# Altium schematic sheet analogSwitch.SchDoc
size Letter
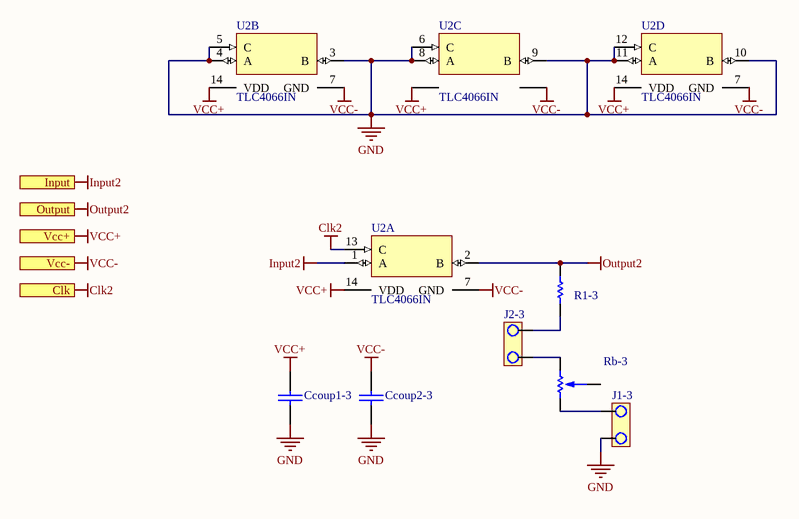
[diagram p0: analogSwitch.SchDoc]

## Parts
Ccoup1-3  CAP  [CAP200]  (value not drawn)
Ccoup2-3  CAP  [CAP200]  (value not drawn)
J1-3  JUMPER  [JUMPER2]  (value not drawn)
J2-3  JUMPER  [JUMPER2]  (value not drawn)
R1-3  Res1  [AXIAL-0.3]  (value not drawn)
Rb-3  PRESET  [PRESET V]  (value not drawn)
U2  TLC4066IN  [N014]  (parts A,B,C,D of 4)

## Ports
Clk, Input, Output, Vcc+, Vcc-

## Nets
Clk2: U2.13(C) ; port Clk
GND: Ccoup1-3.2 Ccoup2-3.1 Ccoup2-3.2 J1-3.1 U2.3(B) U2.4(A) U2.5(C) U2.6(C) U2.7(GND) U2.8(A) U2.9(B) U2.10(B) U2.11(A) U2.12(C) ; port Vcc-  [also labelled VCC-]
Input2: U2.1(A) ; port Input
Output2: R1-3.2 U2.2(B) ; port Output
VCC+: Ccoup1-3.1 U2.14(VDD) ; port Vcc+  [also labelled VDD]
NetJ1-3_2: J1-3.2 Rb-3.3
NetJ2-3_1: J2-3.1 R1-3.1
NetJ2-3_2: J2-3.2 Rb-3.1

Not connected (* = marked no-connect by the designer): Rb-3 2

## Library data of the parts
R1-3 = Res1: Resistor; Published: 8-Jun-2000; LatestRevisionDate: 17-Jul-2002; LatestRevisionNote: Re-released for DXP Platform.; PackageReference: AXIAL-0.3; Publisher: Altium Limited; PackageDescription: Axial Device, Thru-Hole; 2 Leads; 0.3 in Pin Spacing
U2 = TLC4066IN: Quadruple Bilateral Analog Switch; Published: 8-Jun-2000; LatestRevisionDate: 04-Mar-2005; LatestRevisionNote: Stylized 3D Model Added.; DatasheetVersion: Jan-1986; PackageVersion: Oct-1995; PackageReference: N014; Publisher: Altium Limited; PackageDescription: DIP; 14 Leads; Row Spacing 7.62 mm; Pitch 2.54 mm; ComponentLink1Description: Manufacturer Link; ComponentLink1URL: http://www.ti.com/